# Altium schematic sheet [07] - ZYNQ IO.SchDoc
size A3; DocumentNumber: 3; SheetNumber: 3; SheetTotal: 4
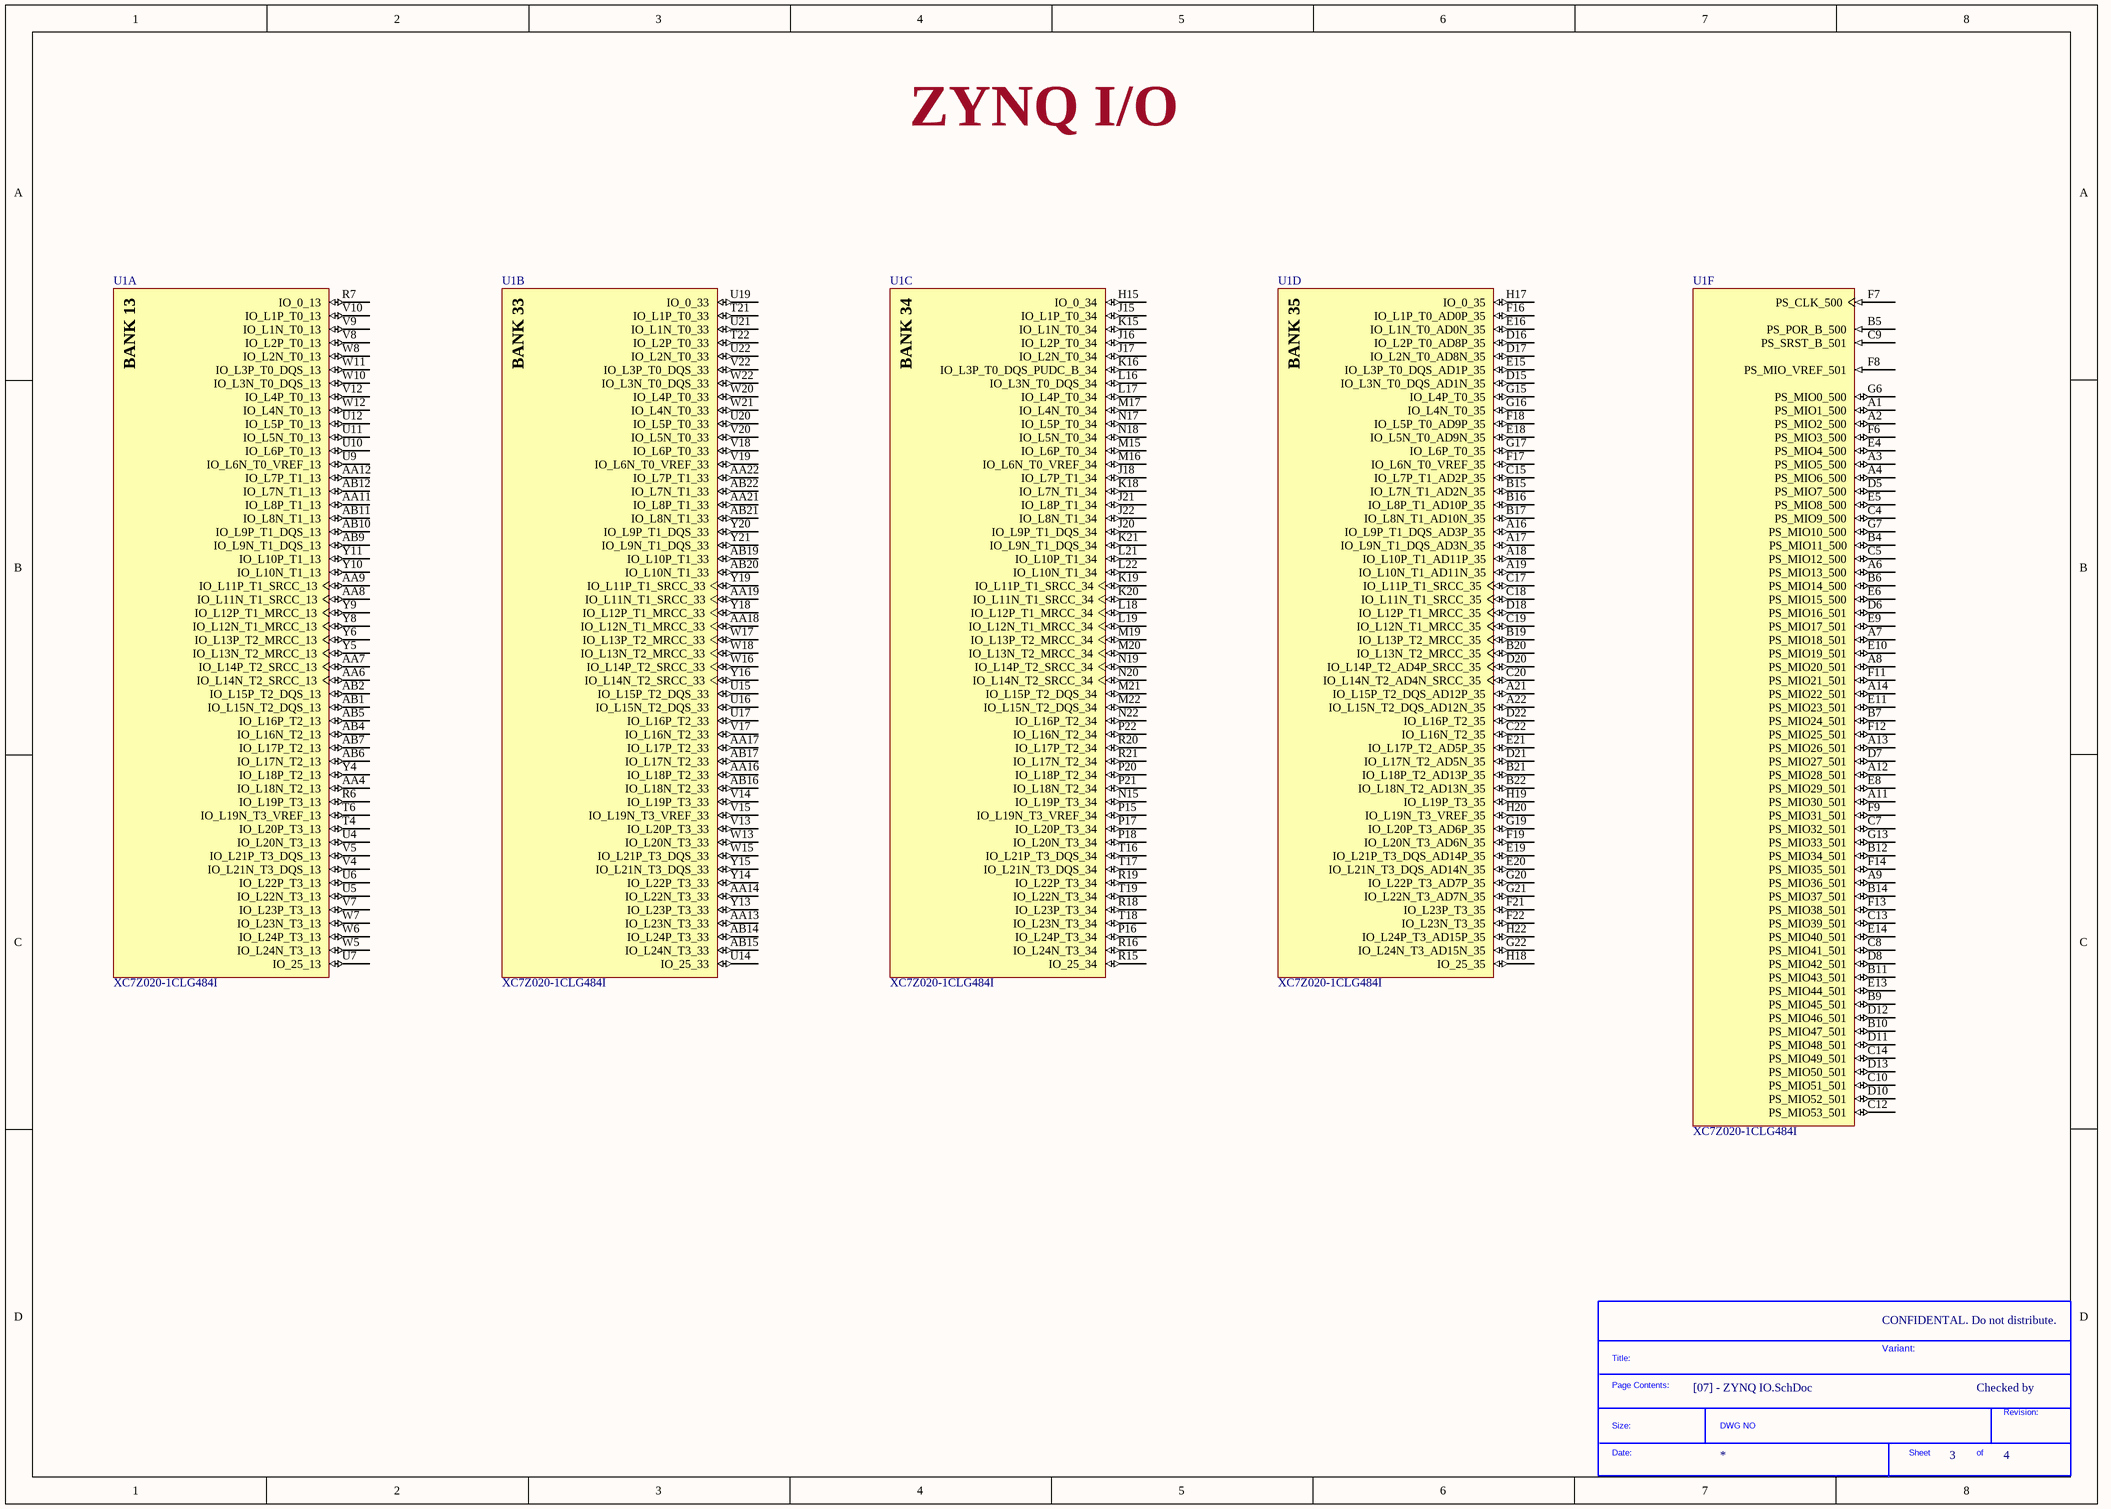
[diagram p0: [07] - ZYNQ IO.SchDoc]

## Parts
*  SDTitleBlock  (value not drawn)  (graphical)
U1  XC7Z020-1CLG484I  [CLG484]  (parts A,B,C,D,F of 10)

## Nets

Not connected (* = marked no-connect by the designer): U1 A1(PS_MIO1_500) A2(PS_MIO2_500) A3(PS_MIO5_500) A4(PS_MIO6_500) A6(PS_MIO13_500) A7(PS_MIO18_501) A8(PS_MIO20_501) A9(PS_MIO36_501) A11(PS_MIO30_501) A12(PS_MIO28_501) A13(PS_MIO26_501) A14(PS_MIO22_501) A16(IO_L9P_T1_DQS_AD3P_35) A17(IO_L9N_T1_DQS_AD3N_35) A18(IO_L10P_T1_AD11P_35) A19(IO_L10N_T1_AD11N_35) A21(IO_L15P_T2_DQS_AD12P_35) A22(IO_L15N_T2_DQS_AD12N_35) AA4(IO_L18N_T2_13) AA6(IO_L14N_T2_SRCC_13) AA7(IO_L14P_T2_SRCC_13) AA8(IO_L11N_T1_SRCC_13) AA9(IO_L11P_T1_SRCC_13) AA11(IO_L8P_T1_13) AA12(IO_L7P_T1_13) AA13(IO_L23N_T3_33) AA14(IO_L22N_T3_33) AA16(IO_L18P_T2_33) AA17(IO_L17P_T2_33) AA18(IO_L12N_T1_MRCC_33) AA19(IO_L11N_T1_SRCC_33) AA21(IO_L8P_T1_33) AA22(IO_L7P_T1_33) AB1(IO_L15N_T2_DQS_13) AB2(IO_L15P_T2_DQS_13) AB4(IO_L16N_T2_13) AB5(IO_L16P_T2_13) AB6(IO_L17N_T2_13) AB7(IO_L17P_T2_13) AB9(IO_L9N_T1_DQS_13) AB10(IO_L9P_T1_DQS_13) AB11(IO_L8N_T1_13) AB12(IO_L7N_T1_13) AB14(IO_L24P_T3_33) AB15(IO_L24N_T3_33) AB16(IO_L18N_T2_33) AB17(IO_L17N_T2_33) AB19(IO_L10P_T1_33) AB20(IO_L10N_T1_33) AB21(IO_L8N_T1_33) AB22(IO_L7N_T1_33) B4(PS_MIO11_500) B5(PS_POR_B_500) B6(PS_MIO14_500) B7(PS_MIO24_501) B9(PS_MIO45_501) B10(PS_MIO47_501) B11(PS_MIO43_501) B12(PS_MIO34_501) B14(PS_MIO37_501) B15(IO_L7N_T1_AD2N_35) B16(IO_L8P_T1_AD10P_35) B17(IO_L8N_T1_AD10N_35) B19(IO_L13P_T2_MRCC_35) B20(IO_L13N_T2_MRCC_35) B21(IO_L18P_T2_AD13P_35) B22(IO_L18N_T2_AD13N_35) C4(PS_MIO9_500) C5(PS_MIO12_500) C7(PS_MIO32_501) C8(PS_MIO41_501) C9(PS_SRST_B_501) C10(PS_MIO51_501) C12(PS_MIO53_501) C13(PS_MIO39_501) C14(PS_MIO49_501) C15(IO_L7P_T1_AD2P_35) C17(IO_L11P_T1_SRCC_35) C18(IO_L11N_T1_SRCC_35) C19(IO_L12N_T1_MRCC_35) C20(IO_L14N_T2_AD4N_SRCC_35) C22(IO_L16N_T2_35) D5(PS_MIO7_500) D6(PS_MIO16_501) D7(PS_MIO27_501) D8(PS_MIO42_501) D10(PS_MIO52_501) D11(PS_MIO48_501) D12(PS_MIO46_501) D13(PS_MIO50_501) D15(IO_L3N_T0_DQS_AD1N_35) D16(IO_L2P_T0_AD8P_35) D17(IO_L2N_T0_AD8N_35) D18(IO_L12P_T1_MRCC_35) D20(IO_L14P_T2_AD4P_SRCC_35) D21(IO_L17N_T2_AD5N_35) D22(IO_L16P_T2_35) E4(PS_MIO4_500) E5(PS_MIO8_500) E6(PS_MIO15_500) E8(PS_MIO29_501) E9(PS_MIO17_501) E10(PS_MIO19_501) E11(PS_MIO23_501) E13(PS_MIO44_501) E14(PS_MIO40_501) E15(IO_L3P_T0_DQS_AD1P_35) E16(IO_L1N_T0_AD0N_35) E18(IO_L5N_T0_AD9N_35) E19(IO_L21P_T3_DQS_AD14P_35) E20(IO_L21N_T3_DQS_AD14N_35) E21(IO_L17P_T2_AD5P_35) F6(PS_MIO3_500) F7(PS_CLK_500) F8(PS_MIO_VREF_501) F9(PS_MIO31_501) F11(PS_MIO21_501) F12(PS_MIO25_501) F13(PS_MIO38_501) F14(PS_MIO35_501) F16(IO_L1P_T0_AD0P_35) F17(IO_L6N_T0_VREF_35) F18(IO_L5P_T0_AD9P_35) F19(IO_L20N_T3_AD6N_35) F21(IO_L23P_T3_35) F22(IO_L23N_T3_35) G6(PS_MIO0_500) G7(PS_MIO10_500) G13(PS_MIO33_501) G15(IO_L4P_T0_35) G16(IO_L4N_T0_35) G17(IO_L6P_T0_35) G19(IO_L20P_T3_AD6P_35) G20(IO_L22P_T3_AD7P_35) G21(IO_L22N_T3_AD7N_35) G22(IO_L24N_T3_AD15N_35) H15(IO_0_34) H17(IO_0_35) H18(IO_25_35) H19(IO_L19P_T3_35) H20(IO_L19N_T3_VREF_35) H22(IO_L24P_T3_AD15P_35) J15(IO_L1P_T0_34) J16(IO_L2P_T0_34) J17(IO_L2N_T0_34) J18(IO_L7P_T1_34) J20(IO_L9P_T1_DQS_34) J21(IO_L8P_T1_34) J22(IO_L8N_T1_34) K15(IO_L1N_T0_34) K16(IO_L3P_T0_DQS_PUDC_B_34) K18(IO_L7N_T1_34) K19(IO_L11P_T1_SRCC_34) K20(IO_L11N_T1_SRCC_34) K21(IO_L9N_T1_DQS_34) L16(IO_L3N_T0_DQS_34) L17(IO_L4P_T0_34) L18(IO_L12P_T1_MRCC_34) L19(IO_L12N_T1_MRCC_34) L21(IO_L10P_T1_34) L22(IO_L10N_T1_34) M15(IO_L6P_T0_34) M16(IO_L6N_T0_VREF_34) M17(IO_L4N_T0_34) M19(IO_L13P_T2_MRCC_34) M20(IO_L13N_T2_MRCC_34) M21(IO_L15P_T2_DQS_34) M22(IO_L15N_T2_DQS_34) N15(IO_L19P_T3_34) N17(IO_L5P_T0_34) N18(IO_L5N_T0_34) N19(IO_L14P_T2_SRCC_34) N20(IO_L14N_T2_SRCC_34) N22(IO_L16P_T2_34) P15(IO_L19N_T3_VREF_34) P16(IO_L24P_T3_34) P17(IO_L20P_T3_34) P18(IO_L20N_T3_34) P20(IO_L18P_T2_34) P21(IO_L18N_T2_34) P22(IO_L16N_T2_34) R6(IO_L19P_T3_13) R7(IO_0_13) R15(IO_25_34) R16(IO_L24N_T3_34) R18(IO_L23P_T3_34) R19(IO_L22P_T3_34) R20(IO_L17P_T2_34) R21(IO_L17N_T2_34) T4(IO_L20P_T3_13) T6(IO_L19N_T3_VREF_13) T16(IO_L21P_T3_DQS_34) T17(IO_L21N_T3_DQS_34) T18(IO_L23N_T3_34) T19(IO_L22N_T3_34) T21(IO_L1P_T0_33) T22(IO_L2P_T0_33) U4(IO_L20N_T3_13) U5(IO_L22N_T3_13) U6(IO_L22P_T3_13) U7(IO_25_13) U9(IO_L6N_T0_VREF_13) U10(IO_L6P_T0_13) U11(IO_L5N_T0_13) U12(IO_L5P_T0_13) U14(IO_25_33) U15(IO_L15P_T2_DQS_33) U16(IO_L15N_T2_DQS_33) U17(IO_L16P_T2_33) U19(IO_0_33) U20(IO_L5P_T0_33) U21(IO_L1N_T0_33) U22(IO_L2N_T0_33) V4(IO_L21N_T3_DQS_13) V5(IO_L21P_T3_DQS_13) V7(IO_L23P_T3_13) V8(IO_L2P_T0_13) V9(IO_L1N_T0_13) V10(IO_L1P_T0_13) V12(IO_L4P_T0_13) V13(IO_L20P_T3_33) V14(IO_L19P_T3_33) V15(IO_L19N_T3_VREF_33) V17(IO_L16N_T2_33) V18(IO_L6P_T0_33) V19(IO_L6N_T0_VREF_33) V20(IO_L5N_T0_33) V22(IO_L3P_T0_DQS_33) W5(IO_L24N_T3_13) W6(IO_L24P_T3_13) W7(IO_L23N_T3_13) W8(IO_L2N_T0_13) W10(IO_L3N_T0_DQS_13) W11(IO_L3P_T0_DQS_13) W12(IO_L4N_T0_13) W13(IO_L20N_T3_33) W15(IO_L21P_T3_DQS_33) W16(IO_L14P_T2_SRCC_33) W17(IO_L13P_T2_MRCC_33) W18(IO_L13N_T2_MRCC_33) W20(IO_L4P_T0_33) W21(IO_L4N_T0_33) W22(IO_L3N_T0_DQS_33) Y4(IO_L18P_T2_13) Y5(IO_L13N_T2_MRCC_13) Y6(IO_L13P_T2_MRCC_13) Y8(IO_L12N_T1_MRCC_13) Y9(IO_L12P_T1_MRCC_13) Y10(IO_L10N_T1_13) Y11(IO_L10P_T1_13) Y13(IO_L23P_T3_33) Y14(IO_L22P_T3_33) Y15(IO_L21N_T3_DQS_33) Y16(IO_L14N_T2_SRCC_33) Y18(IO_L12P_T1_MRCC_33) Y19(IO_L11P_T1_SRCC_33) Y20(IO_L9P_T1_DQS_33) Y21(IO_L9N_T1_DQS_33)

## Notes on the sheet
- ZYNQ I/O
- CONFIDENTAL. Do not distribute.
- CLOCKS (CPU & PCIE)
- Variant:
- Checked by
- (in symbol SDTitleBlock) Title:; Page Contents:; Revision:; Size:; DWG NO; Date:; Sheet; of
- (in symbol XC7Z020-1CLG484I, part A) BANK 13
- (in symbol XC7Z020-1CLG484I, part B) BANK 33
- (in symbol XC7Z020-1CLG484I, part C) BANK 34
- (in symbol XC7Z020-1CLG484I, part D) BANK 35

## Library data of the parts
U1 = XC7Z020-1CLG484I: IC SOC CORTEX-A9 ARTIX-7 484BGA; Manufacturer: Xilinx Inc.; Architecture: MCU, FPGA; Core Processor: Dual ARM® Cortex®-A9 MPCore™ with CoreSight™; MCU RAM: 256KB; Peripherals: DMA; Connectivity: CAN, EBI/EMI, Ethernet, I²C, MMC/SD/SDIO, SPI, UART/USART, USB OTG; Speed: 667MHz; Primary Attributes: Artix™-7 FPGA, 85K Logic Cells; Number of I/O: 130; Supplier 1: Digi-Key; Manufacturer Part Number: XC7Z020-1CLG484I; RoHS: RoHS Compliant; Category: Integrated Circuits (ICs); Stock 1: 188; Pricing 1: 1=128.75 (USD); Packaging: Tray; MCU Flash: -; Operating Temperature: -40°C ~ 100°C; Package / Case: 484-LFBGA, CSPBGA; Supplier Device Package: 484-CSPBGA (19x19); ComponentLink1URL: http://www.xilinx.com/support/documentation/data_sheets/ds190-Zynq-7000-Overview.pdf; ComponentLink1Description: http://www.xilinx.com/support/documentation/data_sheets/ds190-Zynq-7000-Overview.pdf; Supplier Part Number 1: 122-1849-ND